# EAGLE design untitled (EAGLE 7.7.0)
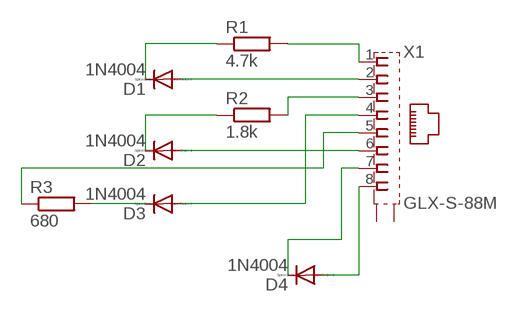
[diagram p0: schematic, sheet 1]

## Parts
D1  1N4004  [DO41-10]
D2  1N4004  [DO41-10]
D3  1N4004  [DO41-10]
D4  1N4004  [DO41-10]
R1  4.7k  R-EU_0309/12  [0309/12]
R2  1.8k  R-EU_0309/12  [0309/12]
R3  680  R-EU_0309/12  [0309/12]
X1  GLX-S-88M  [GLX-S-88M]

## Nets
N$1: D1.A X1.2
N$2: D1.C R1.1
N$3: R1.2 X1.1
N$4: D2.A X1.6
N$5: D2.C R2.1
N$6: R2.2 X1.3
N$7: D3.A X1.4
N$8: D3.C R3.2
N$9: R3.1 X1.5
N$10: D4.A X1.8
N$11: D4.C X1.7
Unconnected: X1.S1 X1.S2

## Library data of the parts
D1-D4 = diode:1N4004: DIODE general purpose rectifier, 1 A; MF: VISHAY; MPN: 1N4004-E3/54; OC_FARNELL: 2335181
R1 = rcl:R-EU_: RESISTOR, European symbol; MF: MULTICOMP; MPN: MCMF0W4FF4701A50; OC_FARNELL: 1126988
R2 = rcl:R-EU_: RESISTOR, European symbol; MF: MULTICOMP; MPN: MCMF0W4FF1801A50; OC_FARNELL: 1129139
R3 = rcl:R-EU_: RESISTOR, European symbol; MF: MULTICOMP; MPN: MF50 680R; OC_FARNELL: 9340823
X1 = my_connector:GLX-S-88M: Mod. Jack, Right Angle, 8 posiotion, 8 contatcs RJ45 Source: GLX-S-88M.pdf; OC_FARNELL: unknown; OC_NEWARK: unknown

## Net classes
0 default: width 0.813 mm, drill 0.508 mm, clearance 0.711 mm

## Board
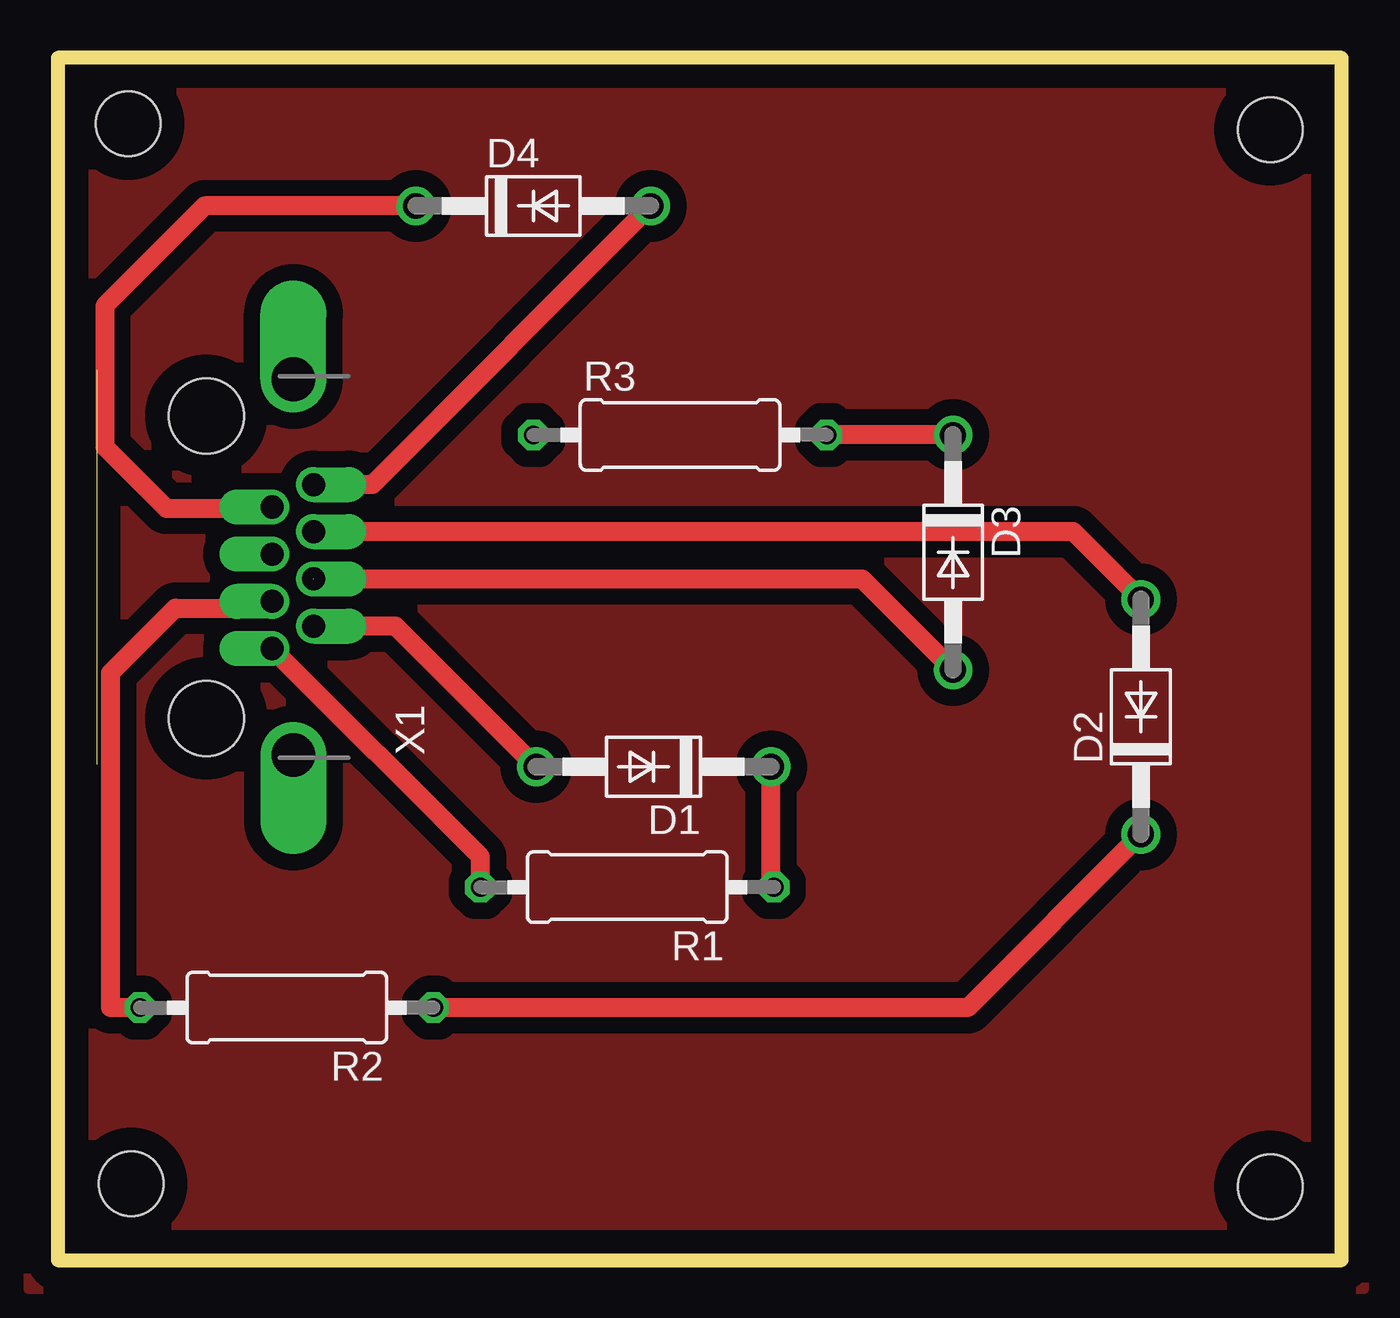
[diagram p1: board, top side]
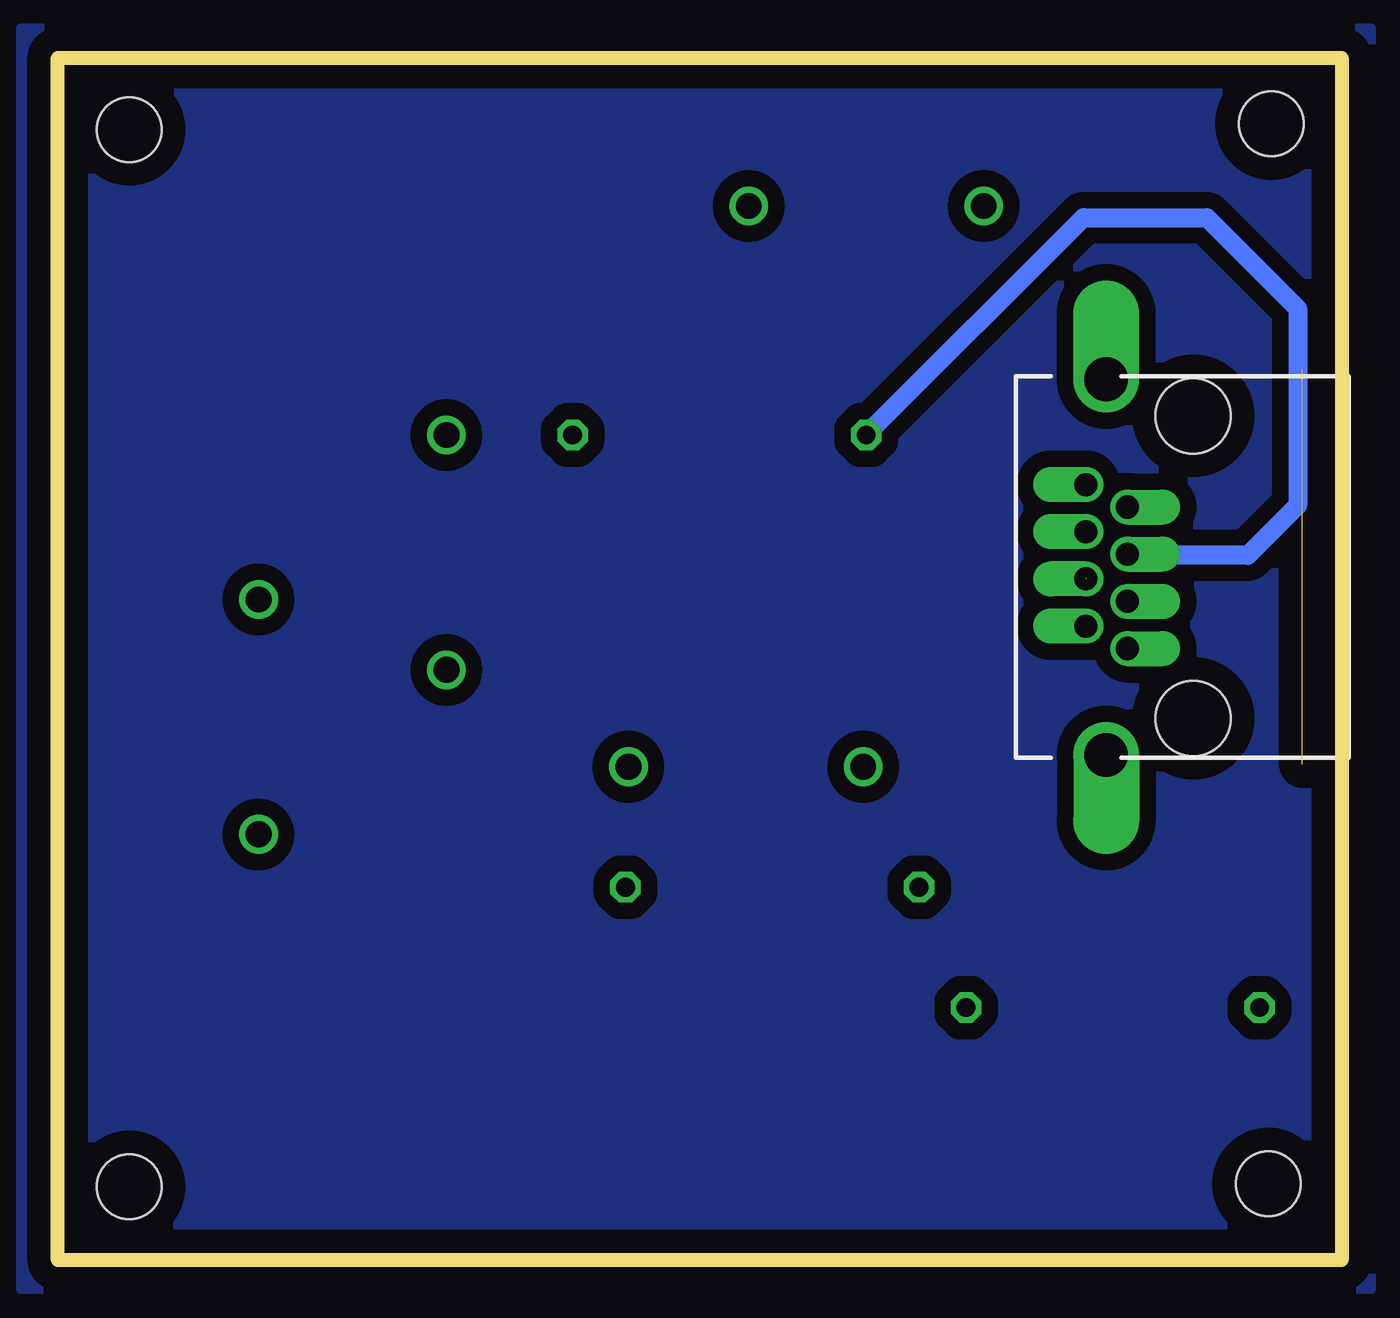
[diagram p2: board, bottom side, seen from below]

Size 55.55 x 52 mm. Coordinates in mm from the lower left corner, seen from the top.
Outline: 0,0 55.55,0 55.55,52 0,52 0,0
Copper layers (1*16): Top 0.035mm / dielectric 1.5mm / Bottom 0.035mm
Design rules "default *": minimum track width 10mil, minimum drill 24mil, track to track 8mil, track to pad 8mil, pad to pad 8mil, via to via 8mil, smd to smd 8mil, copper to edge 40mil, drill to drill 8mil, minimum pad ring 10mil, minimum via ring 8mil, stop-mask expansion 4mil, vias tented up to drill 0mil, thermal gap 10mil
Holes 2.8 mm at 3.17,3.3 52.45,3.17 52.45,48.9 3.05,49.15

### Footprints (pad centres in the part's own frame; a part is rotated, then mirrored left to right if it is on the bottom)
DO41-10 = drill 1.118: A 5.08,0; C -5.08,0
0309/12 = drill 0.813 octagon: 1 -6.35,0; 2 6.35,0
GLX-S-88M = drill 1 pad 1.522 offset: 1 -3.52,-3.05; 2 -2.55,-4.84; 3 -1.48,-3.05; 4 -0.51,-4.84; 5 0.56,-3.05; 6 1.53,-4.84; 7 2.6,-3.05; 8 3.57,-4.84 | drill 1.9 pad 2.5 offset: S1 -8.125,-3.97; S2 8.125,-3.97 | hole 3.25: -6.54,-0.2; 6.54,-0.2

### Placement (x,y rotation side)
D1  25.78,21.34 180 top
D2  46.86,23.5 90 top
D3  38.73,30.61 270 top
D4  20.57,45.59 0 top
R1  24.64,16.13 180 top
R2  9.91,10.92 180 top
R3  26.92,35.69 0 top
X1  6.22,29.97 90 top

### Tracks (layer width: path | path; a pad name or v marks a point on that pad's centre or on a via)
GND
  pour Bottom: -1.27,53.28 -1.27,-1.27 57.15,-1.27 57.15,53.28
  pour Top: -1.27,52.65 -1.27,-1.27 56.52,-1.27 56.52,52.65
N$1
  Top 0.813: D1.A 14.62,27.42 X1.2
N$2
  Top 0.813: R1.1 30.86,16.13 D1.C
N$3
  Top 0.813: R1.2 18.29,17.44 X1.1
N$4
  Top 0.813: D2.A 43.94,31.5 X1.6
N$5
  Top 0.813: D2.C 39.37,10.92 R2.1
N$6
  Top 0.813: R2.2 2.29,10.92 2.29,25.4 5.08,28.19 8.97,28.19 X1.3
N$7  (1 unrouted)
  Top 0.813: 11.05,29.46 34.8,29.46 D3.A 38.86,25.4
N$8
  Top 0.813: D3.C R3.2
N$9
  Bottom 0.813: R3.1 11.18,45.09 5.84,45.09 1.91,41.15 1.91,32.64 4.06,30.48 9.22,30.48 X1.5
N$10
  Top 0.813: D4.A 13.6,33.54 X1.8
N$11
  Top 0.813: D4.C 6.35,45.59 2.03,41.27 2.03,35.18 4.7,32.51 9.21,32.51 X1.7